# Altium project dental-uint-pedal v1_0.PrjPCB
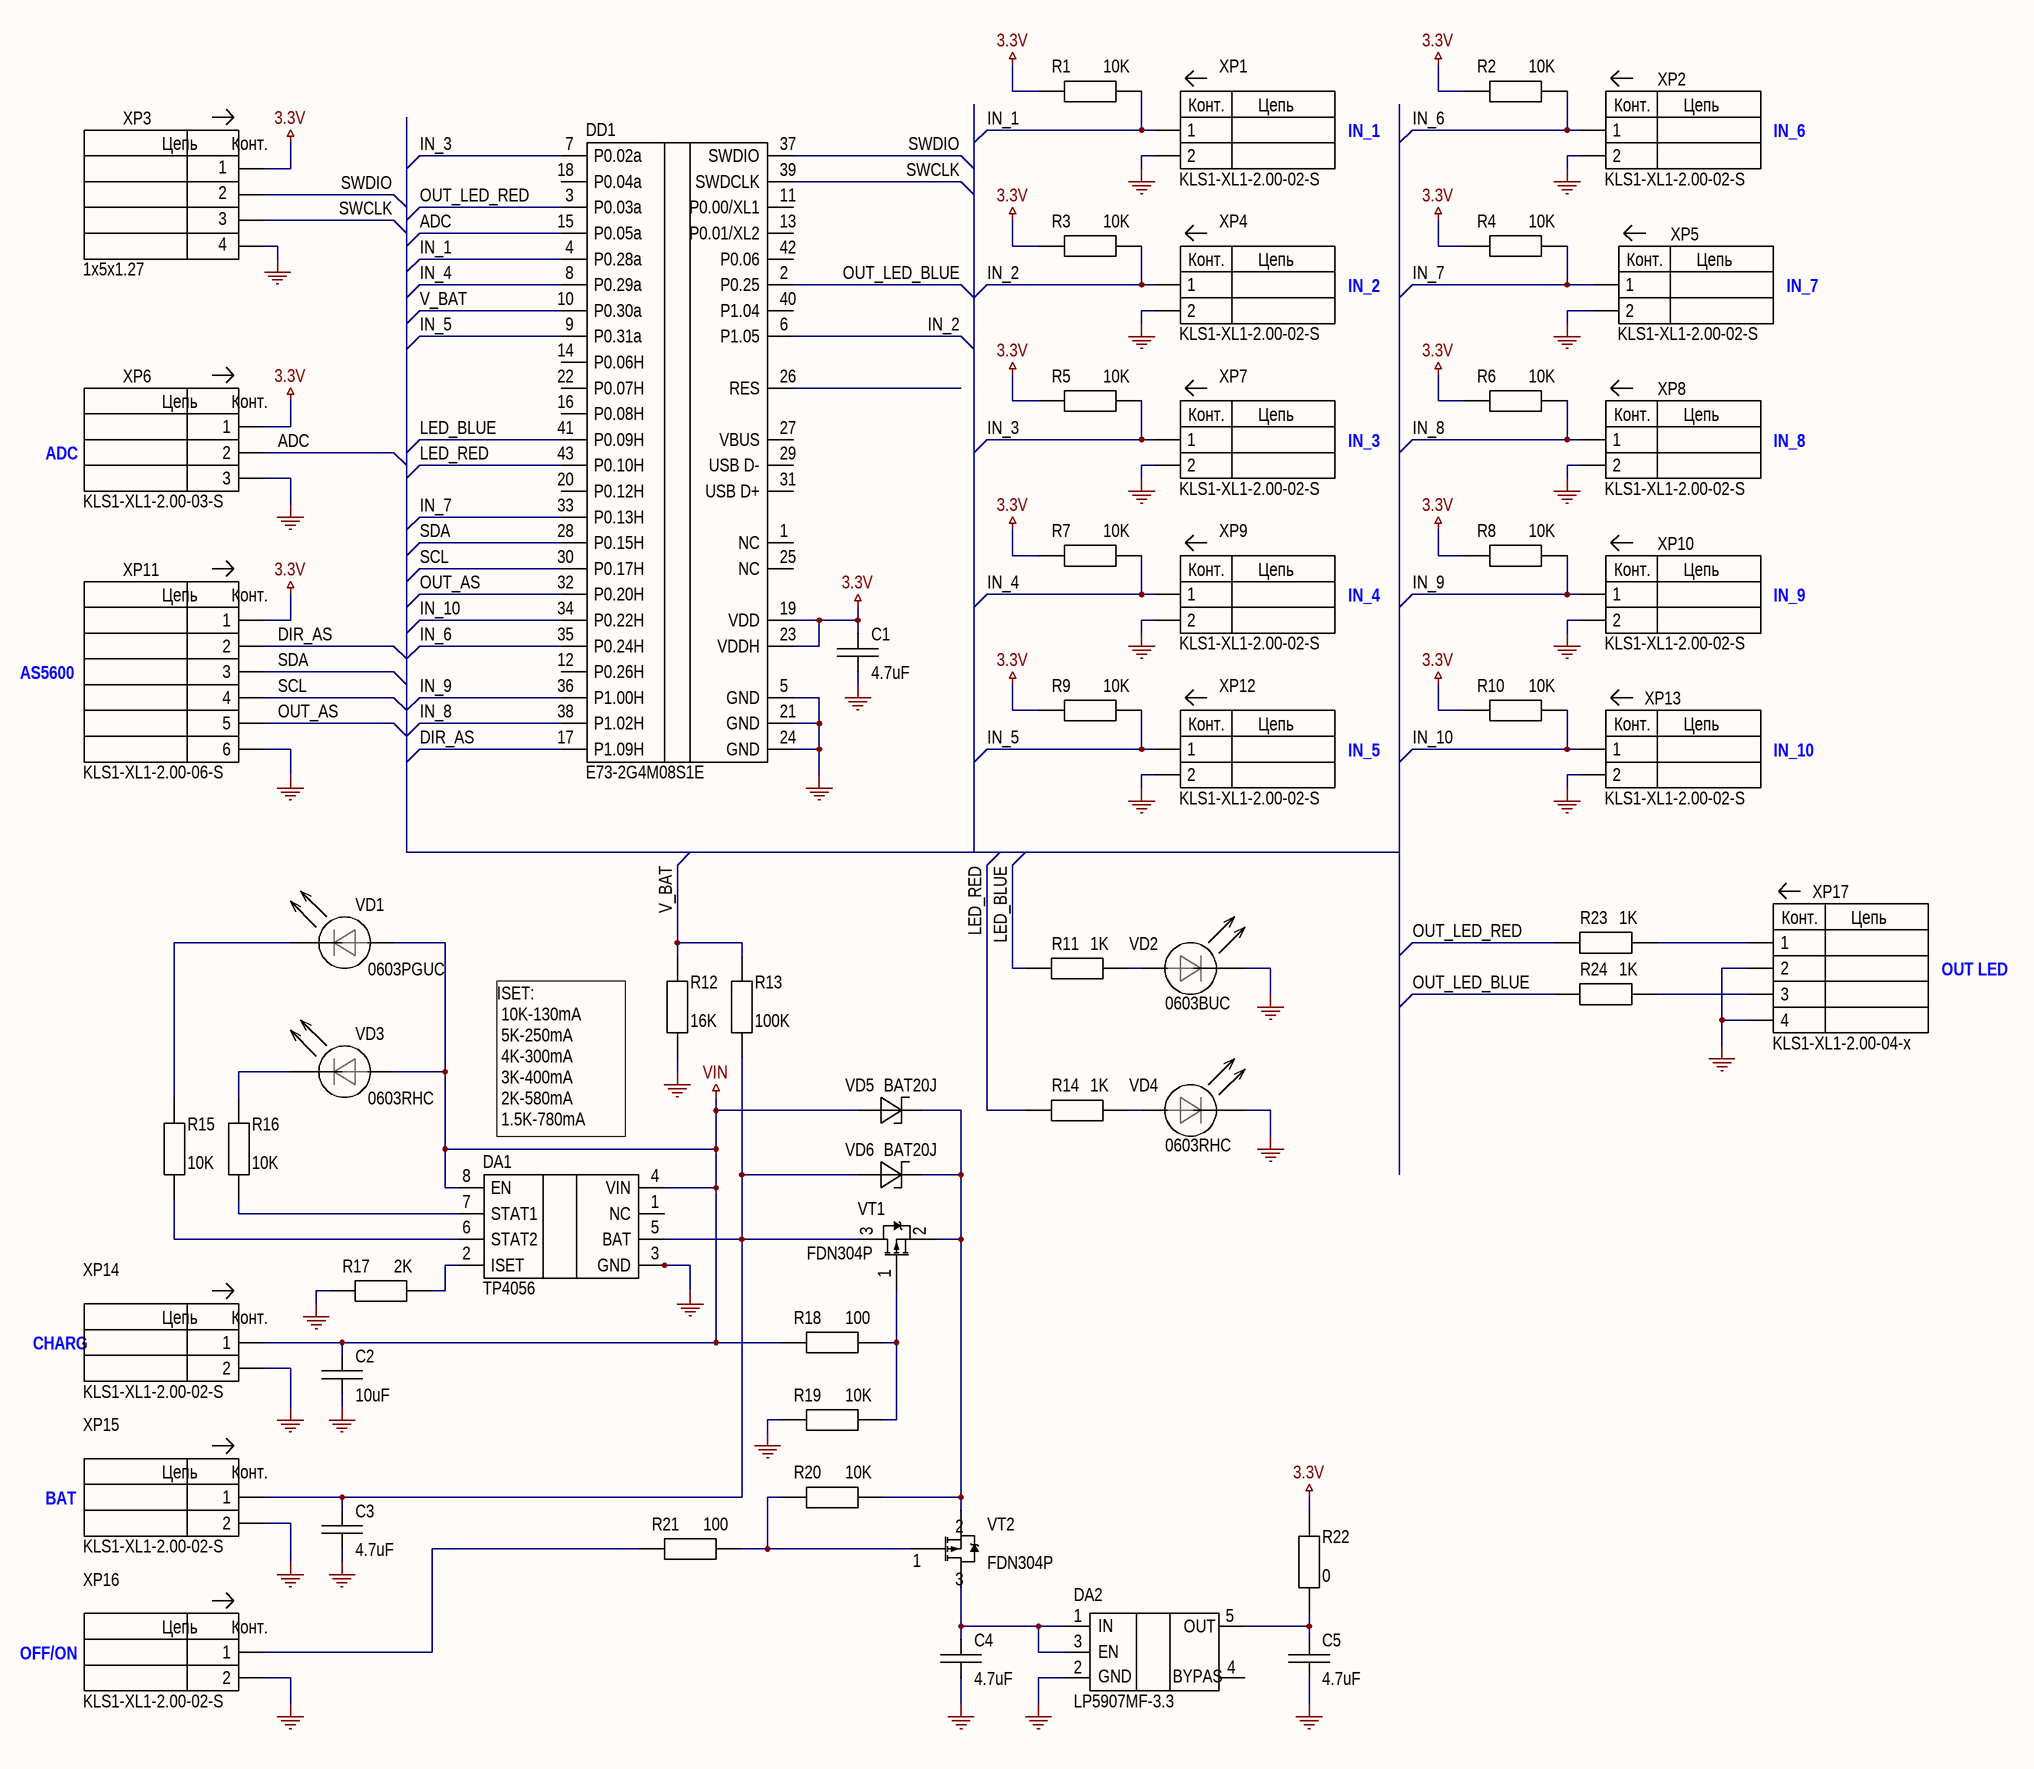
[diagram p0: dental-uint-pedal v1_0.SchDoc]
1 sheet, 57 parts. Net scope: global (net labels, ports and power ports of the same name join across sheets).
Board file: dental-uint-pedal v1_0.PcbDoc

## Sheet dental-uint-pedal v1_0.SchDoc
size 840 x 594 mm

### Parts
C1  value 4.7uF  [CC_0603]  (hidden comment: CL10A475KA8NQNC)
C2  value 10uF  [CC_0603]  (hidden comment: CL10A106KP8NNNC)
C3  value 4.7uF  [CC_0603]  (hidden comment: CL10A475KA8NQNC)
C4  value 4.7uF  [CC_0603]  (hidden comment: CL10A475KA8NQNC)
C5  value 4.7uF  [CC_0603]  (hidden comment: CL10A475KA8NQNC)
DA1  TP4056  [SOIC-8N]
DA2  LP5907MF-3.3  [SOT-23-5]
DD1  E73-2G4M08S1E  [E73-2G4M08S1C]
R1  value 10K  [RC_0603]  (hidden comment: AC0603FR-0710KL)
R2  value 10K  [RC_0603]  (hidden comment: AC0603FR-0710KL)
R3  value 10K  [RC_0603]  (hidden comment: AC0603FR-0710KL)
R4  value 10K  [RC_0603]  (hidden comment: AC0603FR-0710KL)
R5  value 10K  [RC_0603]  (hidden comment: AC0603FR-0710KL)
R6  value 10K  [RC_0603]  (hidden comment: AC0603FR-0710KL)
R7  value 10K  [RC_0603]  (hidden comment: AC0603FR-0710KL)
R8  value 10K  [RC_0603]  (hidden comment: AC0603FR-0710KL)
R9  value 10K  [RC_0603]  (hidden comment: AC0603FR-0710KL)
R10  value 10K  [RC_0603]  (hidden comment: AC0603FR-0710KL)
R11  value 1K  [RC_0603]  (hidden comment: AC0603FR-071KL)
R12  value 16K  [RC_0603]  (hidden comment: AC0603JR-0716KL)
R13  value 100K  [RC_0603]  (hidden comment: AC0603FR-07100KL)
R14  value 1K  [RC_0603]  (hidden comment: AC0603FR-071KL)
R15  value 10K  [RC_0603]  (hidden comment: AC0603FR-0710KL)
R16  value 10K  [RC_0603]  (hidden comment: AC0603FR-0710KL)
R17  value 2K  [RC_0603]  (hidden comment: AC0603FR-072KL)
R18  value 100  [RC_0603]  (hidden comment: RC0603FR-07100RL)
R19  value 10K  [RC_0603]  (hidden comment: AC0603FR-0710KL)
R20  value 10K  [RC_0603]  (hidden comment: AC0603FR-0710KL)
R21  value 100  [RC_0603]  (hidden comment: RC0603FR-07100RL)
R22  value 0  [RC_0603]  (hidden comment: AC0603FR-070RL)
R23  value 1K  [RC_0603]  (hidden comment: AC0603FR-071KL)
R24  value 1K  [RC_0603]  (hidden comment: AC0603FR-071KL)
VD1  0603PGUC  [LED_0603]
VD2  0603BUC  [LED_0603]
VD3  0603RHC  [LED_0603]
VD4  0603RHC  [LED_0603]
VD5  BAT20J  [SOD-323]
VD6  BAT20J  [SOD-323]
VT1  FDN304P  [SOT-23-3]
VT2  FDN304P  [SOT-23-3]
XP1  KLS1-XL1-2.00-02-S  name: IN_1  [KLS1-XL1-2.00-02-S]
XP2  KLS1-XL1-2.00-02-S  name: IN_6  [KLS1-XL1-2.00-02-S]
XP3  1x5x1.27  [XT_1x4x1,27]
XP4  KLS1-XL1-2.00-02-S  name: IN_2  [KLS1-XL1-2.00-02-S]
XP5  KLS1-XL1-2.00-02-S  name: IN_7  [KLS1-XL1-2.00-02-S]
XP6  KLS1-XL1-2.00-03-S  name: ADC  [KLS1-XL1-2.00-03-S]
XP7  KLS1-XL1-2.00-02-S  name: IN_3  [KLS1-XL1-2.00-02-S]
XP8  KLS1-XL1-2.00-02-S  name: IN_8  [KLS1-XL1-2.00-02-S]
XP9  KLS1-XL1-2.00-02-S  name: IN_4  [KLS1-XL1-2.00-02-S]
XP10  KLS1-XL1-2.00-02-S  name: IN_9  [KLS1-XL1-2.00-02-S]
XP11  KLS1-XL1-2.00-06-S  name: AS5600  [KLS1-XL1-2.00-06-S]
XP12  KLS1-XL1-2.00-02-S  name: IN_5  [KLS1-XL1-2.00-02-S]
XP13  KLS1-XL1-2.00-02-S  name: IN_10  [KLS1-XL1-2.00-02-S]
XP14  KLS1-XL1-2.00-02-S  name: CHARG  [KLS1-XL1-2.00-02-S]
XP15  KLS1-XL1-2.00-02-S  name: BAT  [KLS1-XL1-2.00-02-S]
XP16  KLS1-XL1-2.00-02-S  name: OFF/ON  [KLS1-XL1-2.00-02-S]
XP17  KLS1-XL1-2.00-04-x  name: OUT LED  [KLS1-XL1-2.00-04-S]

### Nets
3.3V: C1.2 DD1.19(VDD) DD1.23(VDDH) R1.2 R2.2 R3.2 R4.2 R5.2 R6.2 R7.2 R8.2 R9.2 R10.2 R22.1 XP3.1 XP6.1 XP11.1
GND: C1.1 C2.1 C3.1 C4.1 C5.1 DA1.3(GND) DA1.9(PAD) DA2.2(GND) DD1.5(GND) DD1.21(GND) DD1.24(GND) R12.1 R17.2 R19.1 VD2.2(C) VD4.2(C) XP1.2 XP2.2 XP3.4 XP4.2 XP5.2 XP6.3 XP7.2 XP8.2 XP9.2 XP10.2 XP11.6 XP12.2 XP13.2 XP14.2 XP15.2 XP16.2 XP17.2 XP17.4
VIN: C2.2 DA1.4(VIN) DA1.8(EN) R18.2 VD1.1(A) VD3.1(A) VD5.1(A) XP14.1
ADC: DD1.15(P0.05a) XP6.2
DIR_AS: DD1.17(P1.09H) XP11.2
IN_1: DD1.4(P0.28a) R1.1 XP1.1
IN_2: DD1.6(P1.05) R3.1 XP4.1
IN_3: DD1.7(P0.02a) R5.1 XP7.1
IN_4: DD1.8(P0.29a) R7.1 XP9.1
IN_5: DD1.9(P0.31a) R9.1 XP12.1
IN_6: DD1.35(P0.24H) R2.1 XP2.1
IN_7: DD1.33(P0.13H) R4.1 XP5.1
IN_8: DD1.38(P1.02H) R6.1 XP8.1
IN_9: DD1.36(P1.00H) R8.1 XP10.1
IN_10: DD1.34(P0.22H) R10.1 XP13.1
LED_BLUE: DD1.41(P0.09H) R11.1
LED_RED: DD1.43(P0.10H) R14.1
OUT_AS: DD1.32(P0.20H) XP11.5
OUT_LED_BLUE: DD1.2(P0.25) R24.1
OUT_LED_RED: DD1.3(P0.03a) R23.1
SCL: DD1.30(P0.17H) XP11.4
SDA: DD1.28(P0.15H) XP11.3
SWCLK: DD1.39(SWDCLK) XP3.3
SWDIO: DD1.37(SWDIO) XP3.2
V_BAT: DD1.10(P0.30a) R12.2 R13.2
NetC3_2: C3.2 DA1.5(BAT) R13.1 VD6.1(A) VT1.3(D) XP15.1
NetC4_2: C4.2 DA2.1(IN) DA2.3(EN) VT2.3(D)
NetC5_2: C5.2 DA2.5(OUT) R22.2
NetDA1_2: DA1.2(ISET) R17.1
NetDA1_6: DA1.6(STAT2) R15.1
NetDA1_7: DA1.7(STAT1) R16.1
NetR11_2: R11.2 VD2.1(A)
NetR14_2: R14.2 VD4.1(A)
NetR15_2: R15.2 VD1.2(C)
NetR16_2: R16.2 VD3.2(C)
NetR18_1: R18.1 R19.2 VT1.1(G)
NetR20_1: R20.1 R21.1 VT2.1(G)
NetR20_2: R20.2 VD5.2(C) VD6.2(C) VT1.2(S) VT2.2(S)
NetR21_2: R21.2 XP16.1
NetR23_2: R23.2 XP17.1
NetR24_2: R24.2 XP17.3

Not connected (* = marked no-connect by the designer): DA1 1(NC); DA2 4(NC); DD1 1(NC) 11(P0.00/XL1) 12(P0.26H) 13(P0.01/XL2) 14(P0.06H) 16(P0.08H) 18(P0.04a) 20(P0.12H) 22(P0.07H) 25(NC) 26(RES) 27(VBUS) 29(USB_D-) 31(USB_D+) 40(P1.04) 42(P0.06)

### Notes on the sheet
- ISET:
  10K-130mA
  5K-250mA
  4K-300mA
  3K-400mA
  2K-580mA
  1.5K-780mA
- Перв. примен.
- Справ. №
- Подп. и дата
- Инв. № дубл.
- Взам. инв. №
- Разраб.
- Изм.
- Лист
- № докум.
- Подп.
- Дата
- Лит.
- Масса
- Масштаб
- Пров.
- Т.контр.
- Листов
- Инв. № подл.
- Утв.
- Н.контр.
- 2.106-A1
- Копировал
- Формат А1
- (in symbol KLS1-XL1-2.00-02-x) Цепь; Конт.
- (in symbol KLS1-XL1-2.00-03-x) Цепь; Конт.
- (in symbol KLS1-XL1-2.00-04-x) Конт.; Цепь
- (in symbol KLS1-XL1-2.00-06-x) Цепь; Конт.
- (in symbol LP5907MF-3.3) BYPAS
- (in symbol XT_1x4x1_27) Цепь; Конт.

### Library data of the parts
C1 C3-C5 = C: Cap Ceramic, 0603, 4.7u, 10%, 25V, X5R (Sumsung); type: CL10A475KA8NQNC
C2 = C: Cap Ceramic, 0603, 10u, 10%, 16V, X5R (Sumsung); type: CL10A106KP8NNNC
DA1 = TP4056: Battery Management; type: TP4056; ComponentLink1Description: datasheet; ComponentLink1URL: https://dlnmh9ip6v2uc.cloudfront.net/datasheets/Prototyping/TP4056.pdf
DA2 = LP5907MF-3.3: LDO, SOT-23-5, 3.3v, 0.25А, @TI; type: LP2981; ComponentLink1Description: New link; ComponentLink1URL: https://cdn.compacttool.ru/downloads/LP5907_TexasInstruments-Datasheet.pdf
DD1 = E73-2G4M08S1E: nRF52833; type: MS88SF2; HelpURL: https://www.minew.com/product/ms88sf2-1y40air/
R1-R10 R15 R16 R19 R20 = R: Res, 0603, 10K, 1%, 0.25W (ф. Yageo); type: AC0603FR-0710KL; power: 0.25W
R11 R14 R23 R24 = R: Res, 0603, 1K 1%, 0.25W (ф. Yageo); type: AC0603FR-071KL; power: 0.25W
R12 = R: Res, 0603, 16K, 1%, 0.25W (ф. Yageo); type: AC0603JR-0716KL; power: 0.25W
R13 = R: Res, 0603, 100K, 1%, 0.25W (ф. Yageo); type: AC0603FR-07100KL; power: 0.25W
R17 = R: Res, 0603, 2K, 1%, 0.25W (ф. Yageo); type: AC0603FR-072KL; power: 0.25W
R18 R21 = R: Res, 0603, 100, 1%, 0.25W (ф. Yageo); type: RC0603FR-07100RL; power: 0.25W
R22 = R: Res, 0603, 0, 1%, 0.25W (ф. Yageo); type: AC0603FR-070RL; power: 0.25W
VD1 = LED: Led, 0603, GREEN, 20mA, 125, 140MCD, CPMELEC
VD2 = LED: Led, 0603, BLUE, 20mA, 125, 140MCD, CPMELEC
VD3 VD4 = LED: Led, 0603, RED, 20mA, 125, 140MCD, CPMELEC
VD5 VD6 = D_schottky
VT1 VT2 = IRLML6402: HEXFET Power MOSFET; type: FDN304P
XP1 XP2 XP4 XP5 XP7-XP10 XP12-XP16 = KLS1-XL1-2.00-02-x: 2.0mm, 2pin, KLS; ComponentLink1Description: link; ComponentLink1URL: https://klsele.com/admin/product_upload/20220615100315L-KLS1-XL1-2.00.pdf
XP3 = XT_1x4x1_27: type: 1x5x1.27; Parameter 1: *
XP6 = KLS1-XL1-2.00-03-x: 2.0mm, 3pin, KLS; ComponentLink1Description: link; ComponentLink1URL: https://klsele.com/admin/product_upload/20220615100315L-KLS1-XL1-2.00.pdf
XP11 = KLS1-XL1-2.00-06-x: 2.0mm, 6pin, KLS; ComponentLink1Description: link; ComponentLink1URL: https://klsele.com/admin/product_upload/20220615100315L-KLS1-XL1-2.00.pdf
XP17 = KLS1-XL1-2.00-04-x: 2.0mm, 4pin, KLS; ComponentLink1Description: link; ComponentLink1URL: https://klsele.com/admin/product_upload/20220615100315L-KLS1-XL1-2.00.pdf